# EAGLE design CV_converter_v06 (EAGLE 8.6.2)
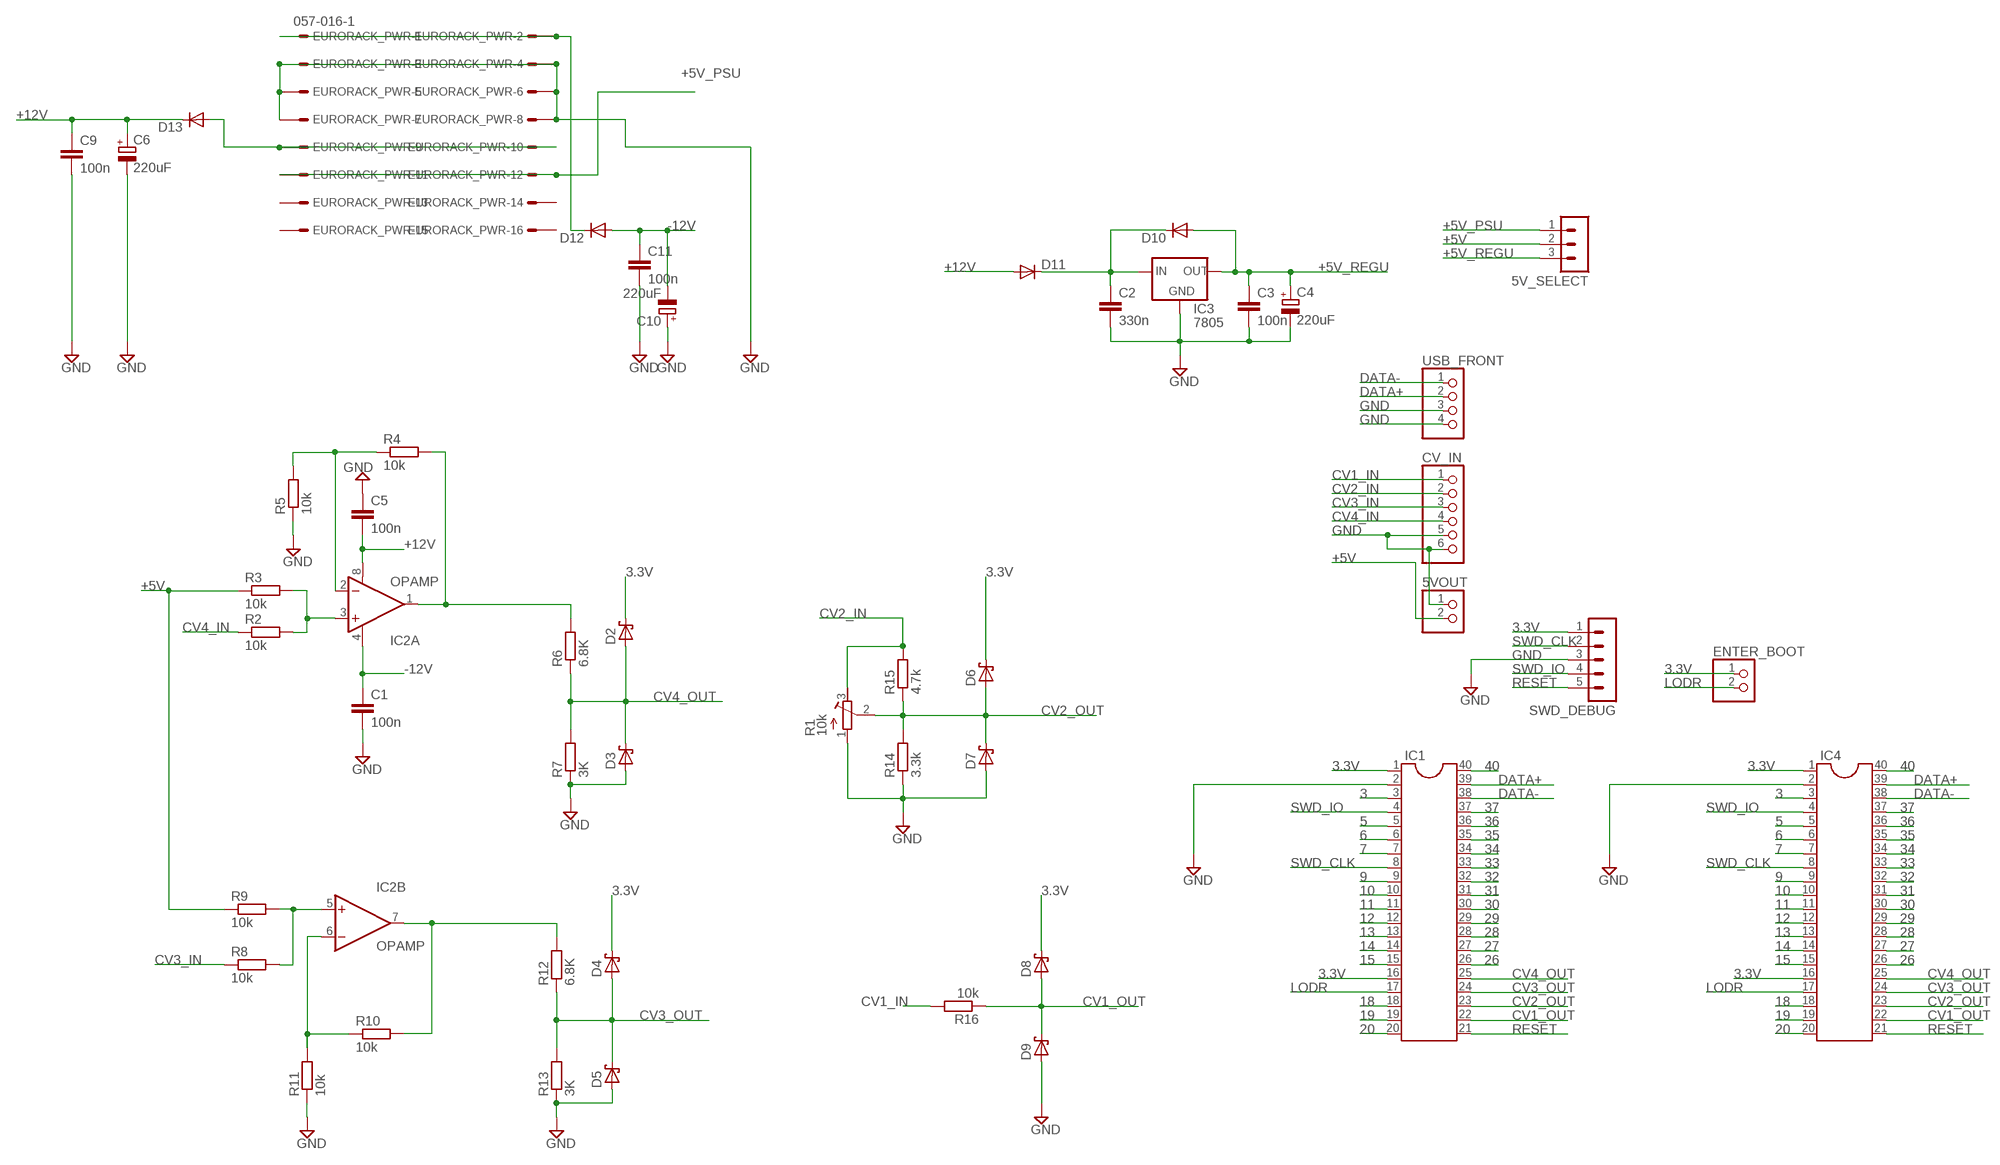
[diagram p0: schematic, sheet 1]

## Parts
5V_SELECT  MA03-1  [MA03-1]
5VOUT  PINHD-1X2  [1X02]
C1  100n  C-EU025-025X050  [C025-025X050]
C2  330n  C-EU025-025X050  [C025-025X050]
C3  100n  C-EU025-025X050  [C025-025X050]
C4  220uF  CPOL-EUE2.5-7  [E2,5-7]
C5  100n  C-EU025-025X050  [C025-025X050]
C6  220uF  CPOL-EUE2.5-7  [E2,5-7]
C9  100n  C-EU025-025X050  [C025-025X050]
C10  220uF  CPOL-EUE2.5-7  [E2,5-7]
C11  100n  C-EU025-025X050  [C025-025X050]
CV_IN  PINHD-1X6  [1X06]
D2  SCHOTTKY-DIODEDO35-7  [DO35-7]
D3  SCHOTTKY-DIODEDO35-7  [DO35-7]
D4  SCHOTTKY-DIODEDO35-7  [DO35-7]
D5  SCHOTTKY-DIODEDO35-7  [DO35-7]
D6  SCHOTTKY-DIODEDO35-7  [DO35-7]
D7  SCHOTTKY-DIODEDO35-7  [DO35-7]
D8  SCHOTTKY-DIODEDO35-7  [DO35-7]
D9  SCHOTTKY-DIODEDO35-7  [DO35-7]
D10  DIODE-D-7.5  [D-7.5]
D11  DIODE-D-7.5  [D-7.5]
D12  DIODE-D-7.5  [D-7.5]
D13  DIODE-D-7.5  [D-7.5]
ENTER_BOOT  PINHD-1X2  [1X02]
EURORACK_PWR  057-016-1  [057-016-1]
IC1  DIL40  [DIL40]
IC2  OPAMP  OPAMP-DUALDIP  [DIP08]
IC3  7805  V_REG_78XX-TO-220  [TO-220-ALT]
IC4  DIL40  [DIL40]
R1  10k  R-TRIMM64W  [RTRIM64W]
R2  10k  R-EU_0207/7  [0207/7]
R3  10k  R-EU_0207/7  [0207/7]
R4  10k  R-EU_0207/7  [0207/7]
R5  10k  R-EU_0207/7  [0207/7]
R6  6.8K  R-EU_0207/7  [0207/7]
R7  3K  R-EU_0207/7  [0207/7]
R8  10k  R-EU_0207/7  [0207/7]
R9  10k  R-EU_0207/7  [0207/7]
R10  10k  R-EU_0207/7  [0207/7]
R11  10k  R-EU_0207/7  [0207/7]
R12  6.8K  R-EU_0207/7  [0207/7]
R13  3K  R-EU_0207/7  [0207/7]
R14  3.3k  R-EU_0207/7  [0207/7]
R15  4.7k  R-EU_0207/7  [0207/7]
R16  10k  R-EU_0207/7  [0207/7]
SWD_DEBUG  MA05-1  [MA05-1]
USB_FRONT  PINHD-1X4  [1X04]

## Nets
3: IC1.3 IC4.3
3.3V: D2.C D4.C D6.C D8.C ENTER_BOOT.1 IC1.1 IC1.16 IC4.1 IC4.16 SWD_DEBUG.1
5: IC1.5 IC4.5
6: IC1.6 IC4.6
7: IC1.7 IC4.7
9: IC1.9 IC4.9
10: IC1.10 IC4.10
11: IC1.11 IC4.11
12: IC1.12 IC4.12
13: IC1.13 IC4.13
14: IC1.14 IC4.14
15: IC1.15 IC4.15
18: IC1.18 IC4.18
19: IC1.19 IC4.19
20: IC1.20 IC4.20
26: IC1.26 IC4.26
27: IC1.27 IC4.27
28: IC1.28 IC4.28
29: IC1.29 IC4.29
30: IC1.30 IC4.30
31: IC1.31 IC4.31
32: IC1.32 IC4.32
33: IC1.33 IC4.33
34: IC1.34 IC4.34
35: IC1.35 IC4.35
36: IC1.36 IC4.36
37: IC1.37 IC4.37
40: IC1.40 IC4.40
+5V: 5V_SELECT.2 5VOUT.2 R3.1 R9.1
+5V_PSU: 5V_SELECT.1 EURORACK_PWR.11 EURORACK_PWR.12
+5V_REGU: 5V_SELECT.3 C3.1 C4.+ D10.A IC3.OUT
+12V: C5.2 C6.+ C9.1 D11.A D13.C IC2.8(A:V+)
-12V: C1.1 C10.- C11.1 D12.A IC2.4(A:V-)
CV1_IN: CV_IN.1 R16.2
CV1_OUT: D8.A D9.C IC1.22 IC4.22 R16.1
CV2_IN: CV_IN.2 R1.3(E) R15.2
CV2_OUT: D6.A D7.C IC1.23 IC4.23 R1.2(S) R14.2 R15.1
CV3_IN: CV_IN.3 R8.1
CV3_OUT: D4.A D5.C IC1.24 IC4.24 R12.1 R13.2
CV4_IN: CV_IN.4 R2.1
CV4_OUT: D2.A D3.C IC1.25 IC4.25 R6.1 R7.2
DATA+: IC1.39 IC4.39 USB_FRONT.2
DATA-: IC1.38 IC4.38 USB_FRONT.1
GND: 5VOUT.1 C1.2 C2.2 C3.2 C4.- C5.1 C6.- C9.2 C10.+ C11.2 CV_IN.5 CV_IN.6 D3.A D5.A D7.A D9.A EURORACK_PWR.3 EURORACK_PWR.4 EURORACK_PWR.5 EURORACK_PWR.6 EURORACK_PWR.7 EURORACK_PWR.8 IC1.2 IC3.GND IC4.2 R1.1(A) R5.1 R7.1 R11.1 R13.1 R14.1 SWD_DEBUG.3 USB_FRONT.3 USB_FRONT.4
LODR: ENTER_BOOT.2 IC1.17 IC4.17
N$2: IC2.1(A:OUT) R4.2 R6.2
N$3: IC2.3(A:+IN) R2.2 R3.2
N$4: C2.1 D10.C D11.C IC3.IN
N$5: IC2.2(A:-IN) R4.1 R5.2
N$6: IC2.6(B:-IN) R10.1 R11.2
N$7: IC2.7(B:OUT) R10.2 R12.2
N$8: IC2.5(B:+IN) R8.2 R9.2
N$10: D12.C EURORACK_PWR.1 EURORACK_PWR.2
N$11: D13.A EURORACK_PWR.9 EURORACK_PWR.10
RESET: IC1.21 IC4.21 SWD_DEBUG.5
SWD_CLK: IC1.8 IC4.8 SWD_DEBUG.2
SWD_IO: IC1.4 IC4.4 SWD_DEBUG.4
Unconnected: EURORACK_PWR.13 EURORACK_PWR.14 EURORACK_PWR.15 EURORACK_PWR.16

## Library data of the parts
5V_SELECT = con-lstb:MA03-1: PIN HEADER; OC_FARNELL: unknown; OC_NEWARK: unknown
5VOUT ENTER_BOOT = pinhead:PINHD-1X2: PIN HEADER
C1-C3 C5 C9 C11 = resistor:C-EU: CAPACITOR, European symbol
C4 C6 C10 = resistor:CPOL-EU: POLARIZED CAPACITOR, European symbol
CV_IN = pinhead:PINHD-1X6: PIN HEADER
D2-D9 = diode:SCHOTTKY-DIODE: Schottky Diode
D10-D13 = diode:DIODE-: DIODE
EURORACK_PWR = con-panduit:057-016-: CONNECTOR 10-pin series 057 contact pc board low profile headers; OC_FARNELL: unknown; OC_NEWARK: unknown
IC1 IC4 = ic-package:DIL40: Dual In Line
IC2 = SparkFun-AnalogIC:OPAMP-DUAL: Generic op-amp footprint
IC3 = SparkFun-PowerIC:V_REG_78XX: Voltage Regulator Standard 7805 5V regulator. IGO (Input Ground Output). Spark Fun Electronics SKU : COM-00107
R1 = resistor:R-TRIMM: Trimm resistor
R2-R16 = rcl:R-EU_: RESISTOR, European symbol
SWD_DEBUG = con-lstb:MA05-1: PIN HEADER; OC_FARNELL: unknown; OC_NEWARK: unknown
USB_FRONT = pinhead:PINHD-1X4: PIN HEADER

## Board
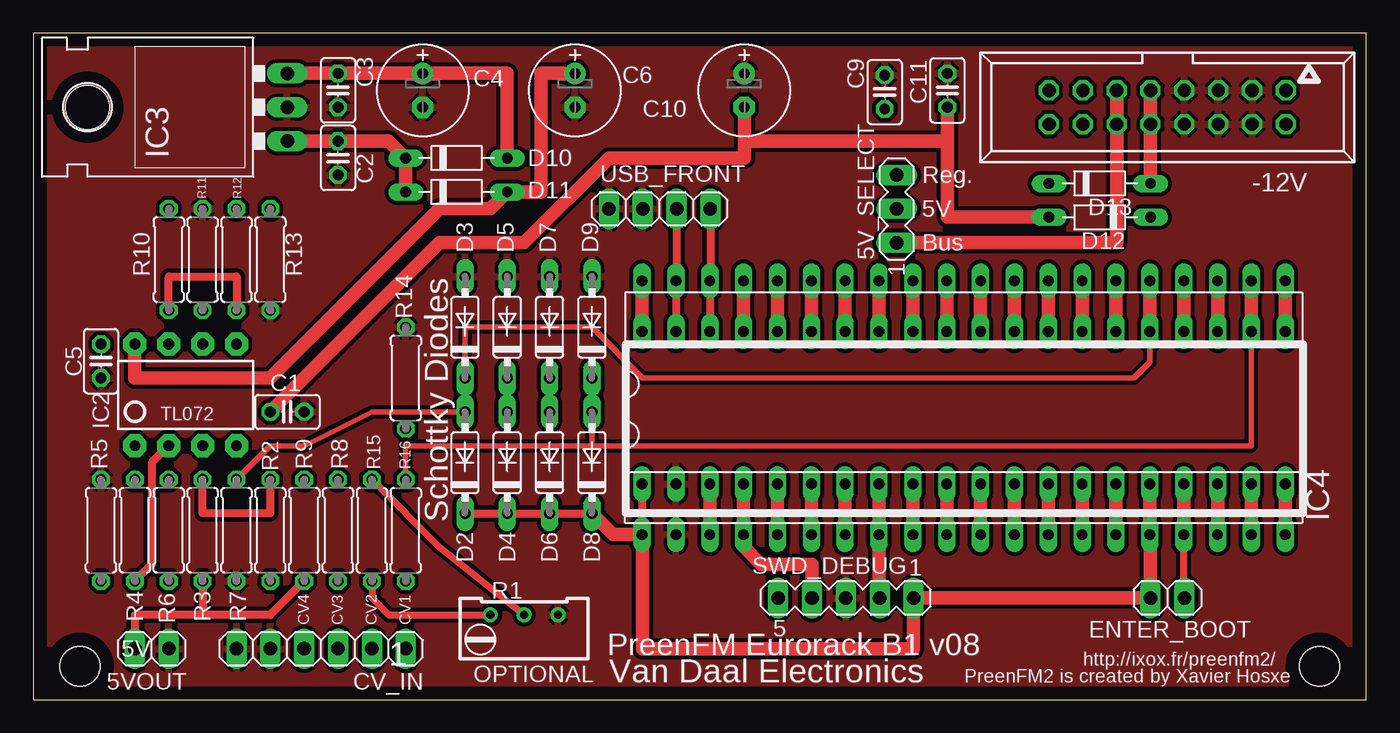
[diagram p1: board, top side]
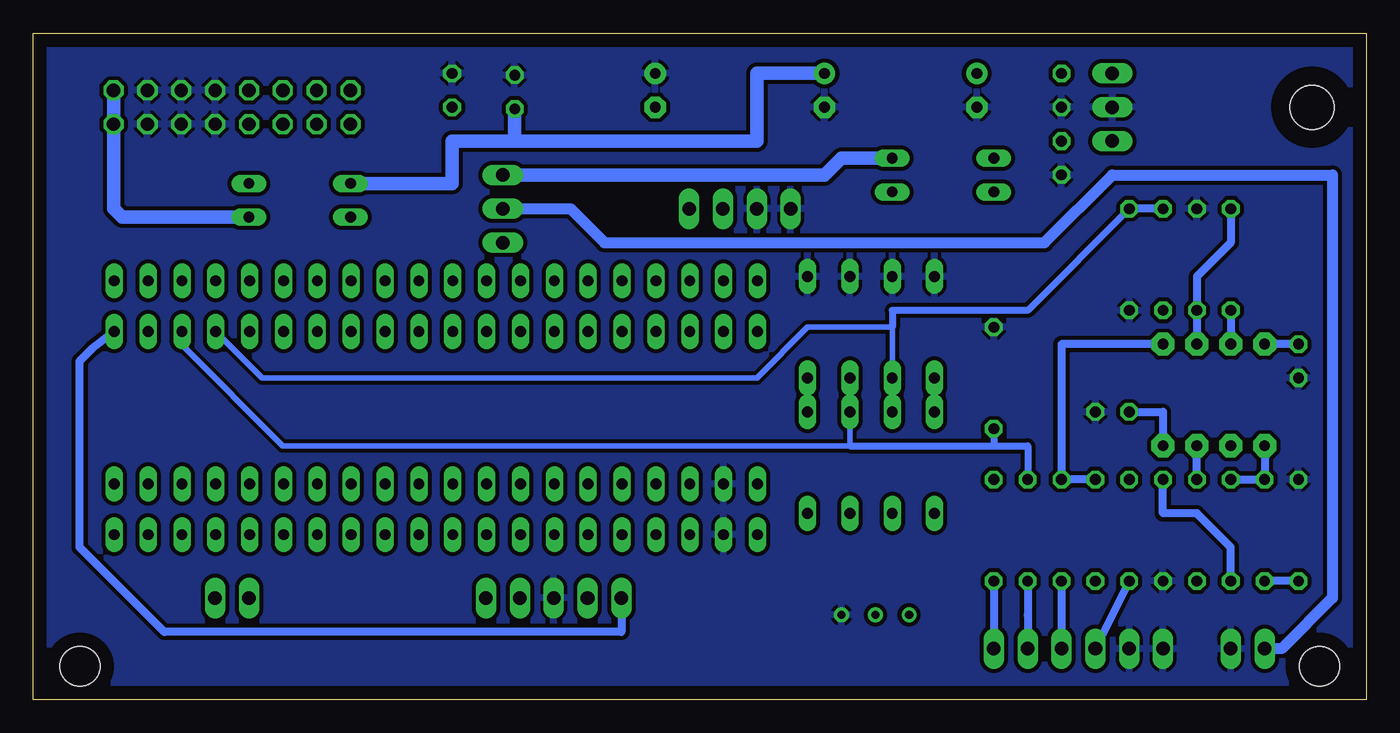
[diagram p2: board, bottom side, seen from below]

Size 100 x 50 mm. Coordinates in mm from the lower left corner, seen from the top.
Outline: 0,0 100,0 100,50 0,50 0,0
Copper layers (1*16): Top 0.035mm / dielectric 1.5mm / Bottom 0.035mm
Design rules "default *": minimum track width 6mil, minimum drill 0.35mm, track to track 12mil, track to pad 12mil, pad to pad 12mil, via to via 6mil, smd to smd 6mil, copper to edge 40mil, drill to drill 6mil, minimum pad ring 10mil, minimum via ring 8mil, stop-mask expansion 4mil, vias tented up to drill 0mil, thermal gap 10mil
Holes 3 mm at 96.5,2.5 3.5,2.5

### Footprints (pad centres in the part's own frame; a part is rotated, then mirrored left to right if it is on the bottom)
MA03-1 = drill 1.016 long: 1 -2.54,0; 2 0,0; 3 2.54,0
1X02 = drill 1.016 long: 1 -1.27,0; 2 1.27,0
C025-025X050 = drill 0.813 octagon: 1 -1.27,0; 2 1.27,0
E2,5-7 = drill 0.813 pad 1.6: + -1.27,0 | drill 0.813 pad 1.6 octagon: - 1.27,0
1X06 = drill 1.016 long: 1 -6.35,0; 2 -3.81,0; 3 -1.27,0; 4 1.27,0; 5 3.81,0; 6 6.35,0
DO35-7 = drill 0.813 long: A 3.81,0; C -3.81,0
D-7.5 = drill 0.813 long: A 3.81,0; C -3.81,0
057-016-1 = drill 1 octagon: 1 -8.89,-1.27; 2 -8.89,1.27; 3 -6.35,-1.27; 4 -6.35,1.27; 5 -3.81,-1.27; 6 -3.81,1.27; 7 -1.27,-1.27; 8 -1.27,1.27; 9 1.27,-1.27; 10 1.27,1.27; 11 3.81,-1.27; 12 3.81,1.27; 13 6.35,-1.27; 14 6.35,1.27; 15 8.89,-1.27; 16 8.89,1.27
DIL40 = drill 0.813 long: 1 -24.13,-7.62; 2 -21.59,-7.62; 3 -19.05,-7.62; 4 -16.51,-7.62; 5 -13.97,-7.62; 6 -11.43,-7.62; 7 -8.89,-7.62; 8 -6.35,-7.62; 9 -3.81,-7.62; 10 -1.27,-7.62; 11 1.27,-7.62; 12 3.81,-7.62; 13 6.35,-7.62; 14 8.89,-7.62; 15 11.43,-7.62; 16 13.97,-7.62; 17 16.51,-7.62; 18 19.05,-7.62; 19 21.59,-7.62; 20 24.13,-7.62; 21 24.13,7.62; 22 21.59,7.62; 23 19.05,7.62; 24 16.51,7.62; 25 13.97,7.62; 26 11.43,7.62; 27 8.89,7.62; 28 6.35,7.62; 29 3.81,7.62; 30 1.27,7.62; 31 -1.27,7.62; 32 -3.81,7.62; 33 -6.35,7.62; 34 -8.89,7.62; 35 -11.43,7.62; 36 -13.97,7.62; 37 -16.51,7.62; 38 -19.05,7.62; 39 -21.59,7.62; 40 -24.13,7.62
DIP08 = drill 0.813 pad 1.727 octagon: 1 -3.81,-3.81; 2 -1.27,-3.81; 3 1.27,-3.81; 4 3.81,-3.81; 5 3.81,3.81; 6 1.27,3.81; 7 -1.27,3.81; 8 -3.81,3.81
TO-220-ALT = drill 1.016 long: GND 0,-3.81; IN -2.54,-3.81; OUT 2.54,-3.81 | hole 3.302: 0,11.176
RTRIM64W = drill 0.61: 1 1.27,-2.54; 2 1.27,0; 3 1.27,2.54
0207/7 = drill 0.813 octagon: 1 -3.81,0; 2 3.81,0
MA05-1 = drill 1.016 long: 1 -5.08,0; 2 -2.54,0; 3 0,0; 4 2.54,0; 5 5.08,0
1X04 = drill 1.016 long: 1 -3.81,0; 2 -1.27,0; 3 1.27,0; 4 3.81,0

### Placement (x,y rotation side)
5V_SELECT  64.77,36.83 90 top
5VOUT  8.89,3.81 180 top
C1  19.05,21.59 0 top
C2  22.86,40.64 270 top
C3  22.86,45.72 270 top
C4  29.21,45.72 270 top
C5  5.08,25.4 90 top
C6  40.64,45.72 270 top
C9  63.88,45.59 90 top
C10  53.34,45.72 270 top
C11  68.58,45.72 90 top
CV_IN  21.59,3.81 180 top
D2  32.38,17.78 90 top
D3  32.38,27.94 90 top
D4  35.56,17.78 90 top
D5  35.56,27.94 90 top
D6  38.73,17.78 90 top
D7  38.73,27.94 90 top
D8  41.91,17.78 90 top
D9  41.91,27.94 90 top
D10  31.75,40.64 0 top
D11  31.75,38.1 0 top
D12  80.01,36.2 180 top
D13  80.01,38.73 0 top
ENTER_BOOT  85.09,7.62 0 top
EURORACK_PWR  85.09,44.45 180 top
IC1  69.8,23.8 0 top
IC2  11.43,22.86 0 top
IC3  15.24,44.45 90 top
IC4  69.8,20 0 top
R1  36.83,5.08 90 top
R2  17.78,12.7 90 top
R3  12.7,12.7 90 top
R4  7.62,12.7 90 top
R5  5.08,12.7 270 top
R6  10.16,12.7 90 top
R7  15.24,12.7 90 top
R8  22.86,12.7 90 top
R9  20.32,12.7 90 top
R10  10.16,33.02 270 top
R11  12.7,33.02 270 top
R12  15.24,33.02 270 top
R13  17.78,33.02 90 top
R14  27.94,24.13 270 top
R15  25.4,12.7 270 top
R16  27.94,12.7 270 top
SWD_DEBUG  60.96,7.62 180 top
USB_FRONT  46.99,36.83 180 top

### Tracks (layer width: path | path; a pad name or v marks a point on that pad's centre or on a via)
3
  Top 1.016: IC1.3 IC4.3
3.3V
  Top 0.61: D2.C D4.C D6.C D8.C | IC1.1 IC4.1
  Top 1.016: IC1.16 IC4.16 83.82,12.33 ENTER_BOOT.1 SWD_DEBUG.1 66.04,3.81 45.72,3.81 45.72,12.33 IC4.1 43.5,12.38 D8.C
5
  Top 1.016: IC1.5 IC4.5
6
  Top 1.016: IC1.6 IC4.6
7
  Top 1.016: IC1.7 IC4.7
9
  Top 1.016: IC1.9 IC4.9
10
  Top 1.016: IC1.10 IC4.10
11
  Top 1.016: IC1.11 IC4.11
12
  Top 1.016: IC1.12 IC4.12
13
  Top 1.016: IC1.13 IC4.13
14
  Top 1.016: IC1.14 IC4.14
15
  Top 1.016: IC1.15 IC4.15
18
  Top 1.016: IC1.18 IC4.18
19
  Top 1.016: IC1.19 IC4.19
20
  Top 1.016: IC1.20 IC4.20
26
  Top 1.016: IC1.26 IC4.26
27
  Top 1.016: IC1.27 IC4.27
28
  Top 1.016: IC1.28 IC4.28
29
  Top 1.016: IC1.29 IC4.29
30
  Top 1.016: IC1.30 IC4.30
31
  Top 1.016: IC1.31 IC4.31
32
  Top 1.016: IC1.32 IC4.32
33
  Top 1.016: IC1.33 IC4.33
34
  Top 1.016: IC1.34 IC4.34
35
  Top 1.016: IC1.35 IC4.35
36
  Top 1.016: IC1.36 IC4.36
37
  Top 1.016: IC1.37 IC4.37
40
  Top 1.016: IC1.40 IC4.40
+5V
  Top 0.61: R9.1 17.78,6.35 12.7,6.35 | R3.1 12.7,6.35 | 5VOUT.2 7.62,6.35 12.7,6.35
  Bottom 0.813: 5V_SELECT.2 59.69,36.83 57.15,34.29 24.13,34.29 19.05,39.37 2.54,39.37 2.54,7.62 6.35,3.81 5VOUT.2
+5V_PSU
  Top 1.016: 5V_SELECT.1 81.28,34.29 EURORACK_PWR.12 EURORACK_PWR.11
+5V_REGU
  Top 1.016: IC3.OUT C3.1 C4.+ 35.56,46.99 D10.A
  Bottom 1.016: 5V_SELECT.3 40.64,39.37 39.37,40.64 D10.A
+12V
  Top 1.016: IC2.8 7.62,24.13 17.78,24.13 30.48,36.83 34.29,36.83 D11.A 38.1,38.1 38.1,46.99 C6.+
  Bottom 0.61: C5.2 IC2.8
  Bottom 1.016: D13.C 68.58,38.73 68.58,41.91 63.88,41.91 | 63.88,41.91 45.72,41.91 45.72,46.99 C6.+ | 63.88,41.91 C9.1
-12V
  Top 1.016: 68.58,41.91 C11.1 | 53.34,41.91 53.34,40.64 43.18,40.64 36.83,34.29 30.48,34.29 C1.1 | 53.34,41.91 68.58,41.91 | D12.A 68.58,36.2 68.58,41.91 | C10.- 53.34,41.91
  Bottom 0.61: C1.1 15.24,21.59 IC2.4
CV1_IN
  Bottom 0.61: R16.2 CV_IN.1
CV1_OUT
  Top 0.406: R16.1 27.94,19.05 39.37,19.05 41.91,19.05 | 41.91,19.05 D8.A | 41.91,19.05 82.55,19.05 82.82,19.05 91.39,19.05 IC4.22
  Top 0.508: D9.C D8.A
  Top 1.016: IC1.22 IC4.22
CV2_IN
  Top 0.508: R15.2 25.4,7.62 26.67,6.35 R1.3
  Bottom 0.61: R15.2 25.4,6.35 CV_IN.2
CV2_OUT
  Top 0.508: R15.1 30.48,11.43 R1.2 | D7.C D6.A
  Top 1.016: IC1.23 IC4.23
  Bottom 0.406: IC4.23 88.85,26.62 81.28,19.05 38.73,19.05 D6.A
  Bottom 0.508: 38.73,19.05 27.94,19.05 | 27.94,19.05 25.4,19.05 R15.1 | R14.2 27.94,19.05
CV3_IN
  Bottom 0.61: R8.1 CV_IN.3
CV3_OUT
  Top 0.508: D5.C D4.A
  Top 1.016: IC1.24 IC4.24
  Bottom 0.406: IC4.24 82.82,24.13 45.72,24.13 41.91,27.94 35.56,27.94 D5.C
  Bottom 0.508: R13.2 25.4,29.21 35.56,29.21 35.56,27.94
  Bottom 0.61: R12.1 R13.2
CV4_IN
  Bottom 0.61: R2.1 CV_IN.4
CV4_OUT
  Top 0.406: IC4.25 83.77,25.35 82.55,24.13 45.72,24.13 41.91,27.94 32.38,27.94 D3.C | R7.2 17.78,19.05 20.32,19.05 25.4,21.59 D2.A
  Top 0.508: D3.C D2.A
  Top 1.016: IC1.25 IC4.25
  Bottom 0.61: R6.1 10.16,11.43 12.7,13.97 15.24,13.97 R7.2
DATA+
  Top 0.61: USB_FRONT.2 48.26,31.47 IC1.39 IC4.39
DATA-
  Top 0.61: USB_FRONT.1 50.8,31.47 IC1.38 IC4.38
GND
  pour Top: -2.54,52.07 102.87,52.07 102.87,-2.54 -2.54,-2.54
  pour Bottom: -1.27,50.8 101.6,50.8 101.6,-1.27 -1.27,-1.27
LODR
  Top 0.508: ENTER_BOOT.2 86.31,7.62 IC4.17
  Top 1.016: IC1.17 IC4.17
N$2
  Bottom 0.61: IC2.1 R4.2 R6.2
N$3
  Top 0.61: R2.2 17.78,13.97 12.7,13.97 R3.2
  Bottom 0.61: R3.2 IC2.3
N$4
  Top 1.016: IC3.IN C2.1 26.67,41.91 D10.C D11.C
N$5
  Top 0.61: IC2.2 8.89,17.78 8.89,10.16 R4.1
  Bottom 0.61: R5.2 R4.1
N$6
  Bottom 0.61: IC2.6 R11.2 12.7,31.75 10.16,34.29 R10.1
N$7
  Top 0.61: R10.2 10.16,31.75 15.24,31.75 R12.2
  Bottom 0.61: R10.2 IC2.7
N$8
  Bottom 0.61: IC2.5 22.86,26.67 R8.2 R9.2
N$10
  Bottom 1.016: D12.C 93.34,36.2 93.98,36.83 EURORACK_PWR.2 EURORACK_PWR.1
N$11
  Top 1.016: EURORACK_PWR.9 EURORACK_PWR.10 D13.A
RESET
  Top 1.016: IC1.21 IC4.21
  Bottom 0.61: SWD_DEBUG.5 55.88,5.08 90.17,5.08 96.52,11.43 96.52,25.4 95.57,26.35 IC4.21
SWD_CLK
  Top 1.016: IC1.8 IC4.8 63.45,7.67 SWD_DEBUG.2
SWD_IO
  Top 1.016: IC1.4 IC4.4 53.29,11.48 54.61,10.16 58.42,10.16 SWD_DEBUG.4

### Text on the board
tNames: Reg. | -12V | 5V | Bus | TL072 | Schottky Diodes | CV4 | CV3 | CV2 | CV1 | 5V | 1 | PreenFM Eurorack B1 v08 | http://ixox.fr/preenfm2/ | OPTIONAL | Van Daal Electronics | PreenFM2 is created by Xavier Hosxe